# Altium schematic sheet Watch-Sheet.SchDoc
size A4
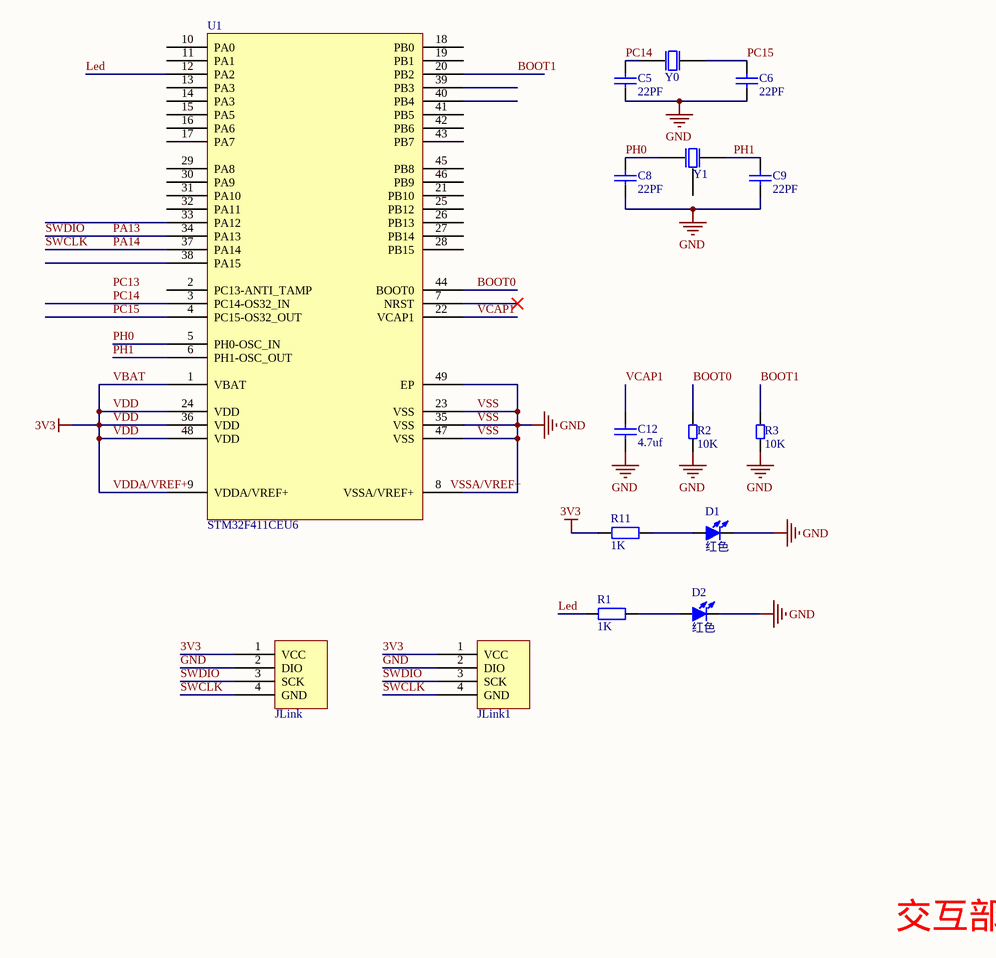
[diagram p0: Watch-Sheet.SchDoc]

## Parts
C5  22PF  [C 0603_M]
C6  22PF  [C 0603_M]
C8  22PF  [C 0603_M]
C9  22PF  [C 0603_M]
C12  value 4.7uf  [C 0603_M]  (hidden comment: Cap Chip 0603)
D1  红色  [LED 0603R]
D2  红色  [LED 0603R]
R1  1K  [R 0603_L]
R2  10K  [R 0603_M]
R3  10K  [R 0603_M]
R11  1K  [R 0603_L]
U1  STM32F411CEU6  [QFN48 7X7_M]
U14  JLink1  [HDR2.54-LI-4P]
U?  JLink  [JLink]
Y0  XTAL 3215 32.768kKHz  [OSC 3215-2P]  (value not drawn)
Y1  XTAL 3225 8M  [OSC 3225-4P]  (value not drawn)

## Nets
3V3: R11.1 U1.1(VBAT) U1.9(VDDA/VREF+) U1.24(VDD) U1.36(VDD) U1.48(VDD) U14.1(VCC) U?.1(VCC)  [also labelled VBAT, VDD, VDDA/VREF+]
GND: C5.1 C6.1 C8.1 C9.1 C12.1 D1.2(K) D2.2(K) R2.1 R3.1 U1.8(VSSA/VREF+) U1.23(VSS) U1.35(VSS) U1.47(VSS) U1.49(EP) U14.2(DIO) U?.2(DIO)  [also labelled VSS]
BOOT0: R2.2 U1.44(BOOT0)
BOOT1: R3.2 U1.20(PB2)
Led: R1.1 U1.12(PA2)
PA13: U1.34(PA13) U14.3(SCK) U?.3(SCK)  [also labelled SWDIO]
PA14: U1.37(PA14) U14.4(GND) U?.4(GND)  [also labelled SWCLK]
PC14: C5.2 U1.3(PC14-OS32_IN) Y0.1(OSC1)
PC15: C6.2 U1.4(PC15-OS32_OUT) Y0.2(OSC2)
PH0: C8.2 U1.5(PH0-OSC_IN) Y1.1(OSC1)
PH1: C9.2 U1.6(PH1-OSC_OUT) Y1.2(OSC2)
VCAP1: C12.2 U1.22(VCAP1)
NetD1_1: D1.1(A) R11.2
NetD2_1: D2.1(A) R1.2

Not connected (* = marked no-connect by the designer): U1 2(PC13-ANTI_TAMP) 7(NRST)* 10(PA0) 11(PA1) 13(PA3) 14(PA3) 15(PA5) 16(PA6) 17(PA7) 18(PB0) 19(PB1) 21(PB10) 25(PB12) 26(PB13) 27(PB14) 28(PB15) 29(PA8) 30(PA9) 31(PA10) 32(PA11) 33(PA12) 38(PA15) 39(PB3) 40(PB4) 41(PB5) 42(PB6) 43(PB7) 45(PB8) 46(PB9); Y1 3(GND)

## Notes on the sheet
- 交互部分
- Labels drawn without touching a wire or pin: PC13, VSSA/VREF+

## Library data of the parts
C5 C6 C8 C9 = 0402 CAP
C12 = Cap Chip 0603: Polarized Capacitor (Radial); Published: 8-Jun-2000; Revision: July-2002: Re-released for DXP Platform.; Publisher: Altium Limited
D1 D2 = LED-SMD: 贴片LED; 版权归属: 源创客; BOM名称: 贴片LED; 学习资源: www.ooocke.com
R1 R11 = R: 贴片电阻; 版权归属: 源创客; BOM名称: 贴片电阻; 学习资源: www.ooocke.com
R2 R3 = 0402 RES
U1 = STM32F401CCU6
U14 = JLink